# EAGLE design Lora Shield v1.3 (EAGLE 7.3.0)

## Sheet 1 of 2
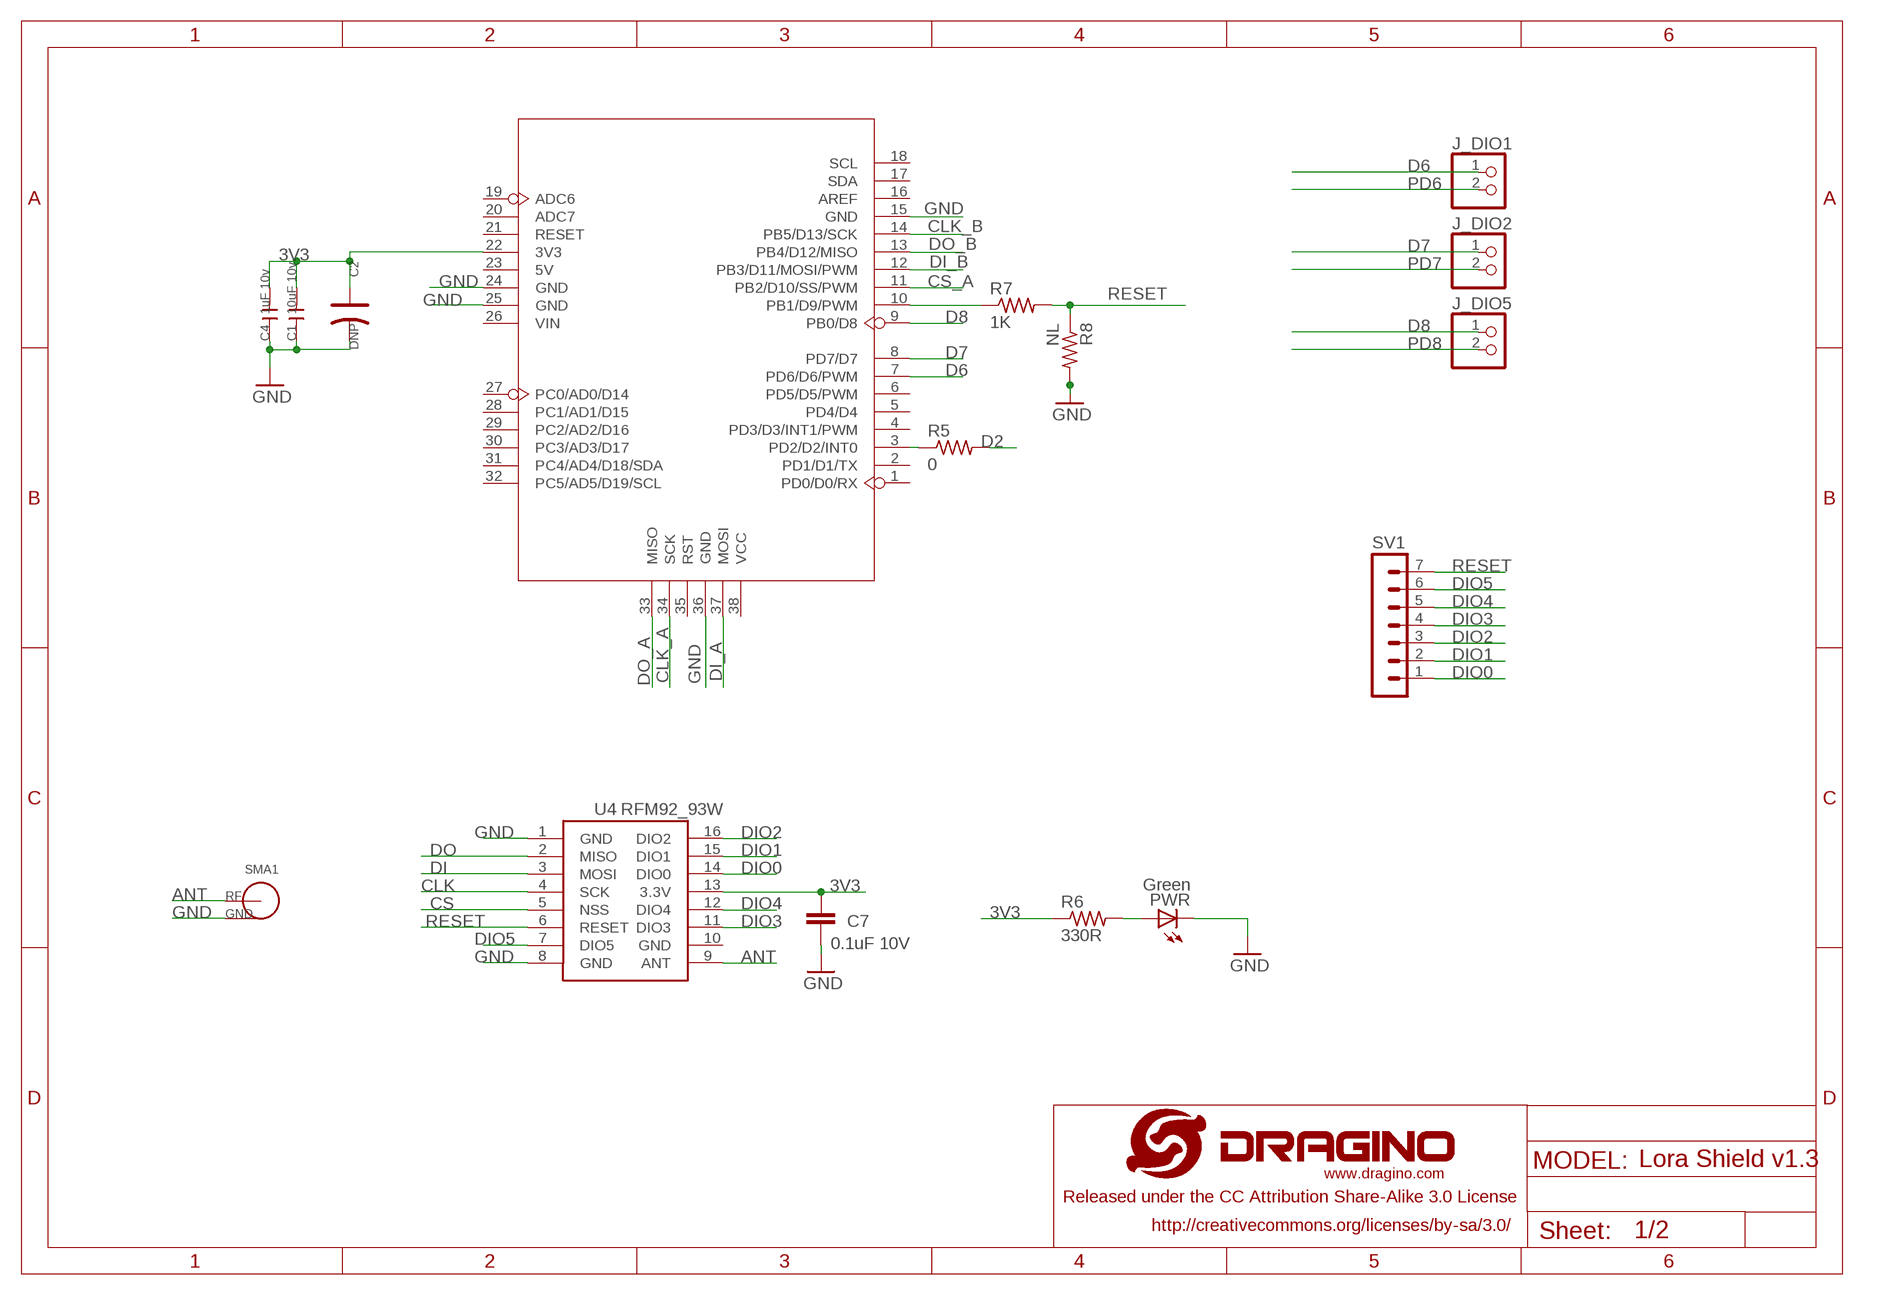
[diagram p0: schematic, sheet 1]

### Parts
C1  10uF 10v  C-0805  [C0805]
C2  DNP  CAP-AVX-A  [AVX-A]
C4  1uF 10v  C-0805  [C0805]
C7  0.1uF 10V  C-EUC0402  [C0402]
J_DIO1  PINHD-1X2  [1X02]
J_DIO2  PINHD-1X2  [1X02]
J_DIO5  PINHD-1X2  [1X02]
PWR  Green  LEDCHIP-LED0603  [CHIP-LED0603]
R5  0  R-US_R0603  [R0603]
R6  330R  R-US_R0402  [R0402]
R7  1K  R-US_R0402  [R0402]
R8  NL  R-US_R0402  [R0402]
SMA1  SMA-KWE  [SMA-KWE]
SV1  MA07-1  [MA07-1]
U4  RFM92_93W  [RFM92_93W]
U5  MOUDLE_ARDUINO-38P328P_NO_VIA  [MOUDLE_ARDUINO-328P--]
U$1  LOGO-NEW  [LOGO-SILK-NEW]

### Nets
3V3: C1.2 C2.+ C4.2 C7.2 R6.1 U4.13(3.3V) U5.22(3V3) ; also sheet 2
ANT: SMA1.1(SIG) U4.9(ANT)
CLK: U4.4(SCK) ; also sheet 2
CLK_A: U5.34(SCK) ; also sheet 2
CLK_B: U5.14(PB5/D13/SCK) ; also sheet 2
CS: U4.5(NSS) ; also sheet 2
CS_A: U5.11(PB2/D10/SS/PWM) ; also sheet 2
D2: R5.2 ; also sheet 2
D6: J_DIO1.1 U5.7(PD6/D6/PWM)
D7: J_DIO2.1 U5.8(PD7/D7)
D8: J_DIO5.1 U5.9(PB0/D8)
DI: U4.3(MOSI) ; also sheet 2
DI_A: U5.37(MOSI) ; also sheet 2
DI_B: U5.12(PB3/D11/MOSI/PWM) ; also sheet 2
DIO0: SV1.1 U4.14(DIO0) ; also sheet 2
DIO1: SV1.2 U4.15(DIO1) ; also sheet 2
DIO2: SV1.3 U4.16(DIO2) ; also sheet 2
DIO3: SV1.4 U4.11(DIO3)
DIO4: SV1.5 U4.12(DIO4)
DIO5: SV1.6 U4.7(DIO5) ; also sheet 2
DO: U4.2(MISO) ; also sheet 2
DO_A: U5.33(MISO) ; also sheet 2
DO_B: U5.13(PB4/D12/MISO) ; also sheet 2
GND: C1.1 C2.- C4.1 C7.1 PWR.C R8.2 SMA1.2(GND) SMA1.3(GND) SMA1.4(GND) SMA1.5(GND) U4.1(GND) U4.8(GND) U5.15(GND) U5.25(GND) U5.36(GND) ; also sheet 2
N$1: R5.1 U5.3(PD2/D2/INT0)
N$6: PWR.A R6.2
N$7: R7.1 U5.10(PB1/D9/PWM)
PD6: J_DIO1.2 ; also sheet 2
PD7: J_DIO2.2 ; also sheet 2
PD8: J_DIO5.2 ; also sheet 2
RESET: R7.2 R8.1 SV1.7 U4.6(RESET)
Unconnected: U5.1(PD0/D0/RX) U5.2(PD1/D1/TX) U5.4(PD3/D3/INT1/PWM) U5.5(PD4/D4) U5.6(PD5/D5/PWM) U5.16(AREF) U5.17(SDA) U5.18(SCL) U5.19(ADC6) U5.20(ADC7) U5.21(RESET) U5.23(5V) U5.24(GND) U5.26(VIN) U5.27(PC0/AD0/D14) U5.28(PC1/AD1/D15) U5.29(PC2/AD2/D16) U5.30(PC3/AD3/D17) U5.31(PC4/AD4/D18/SDA) U5.32(PC5/AD5/D19/SCL) U5.35(RST) U5.38(VCC)

## Sheet 2 of 2
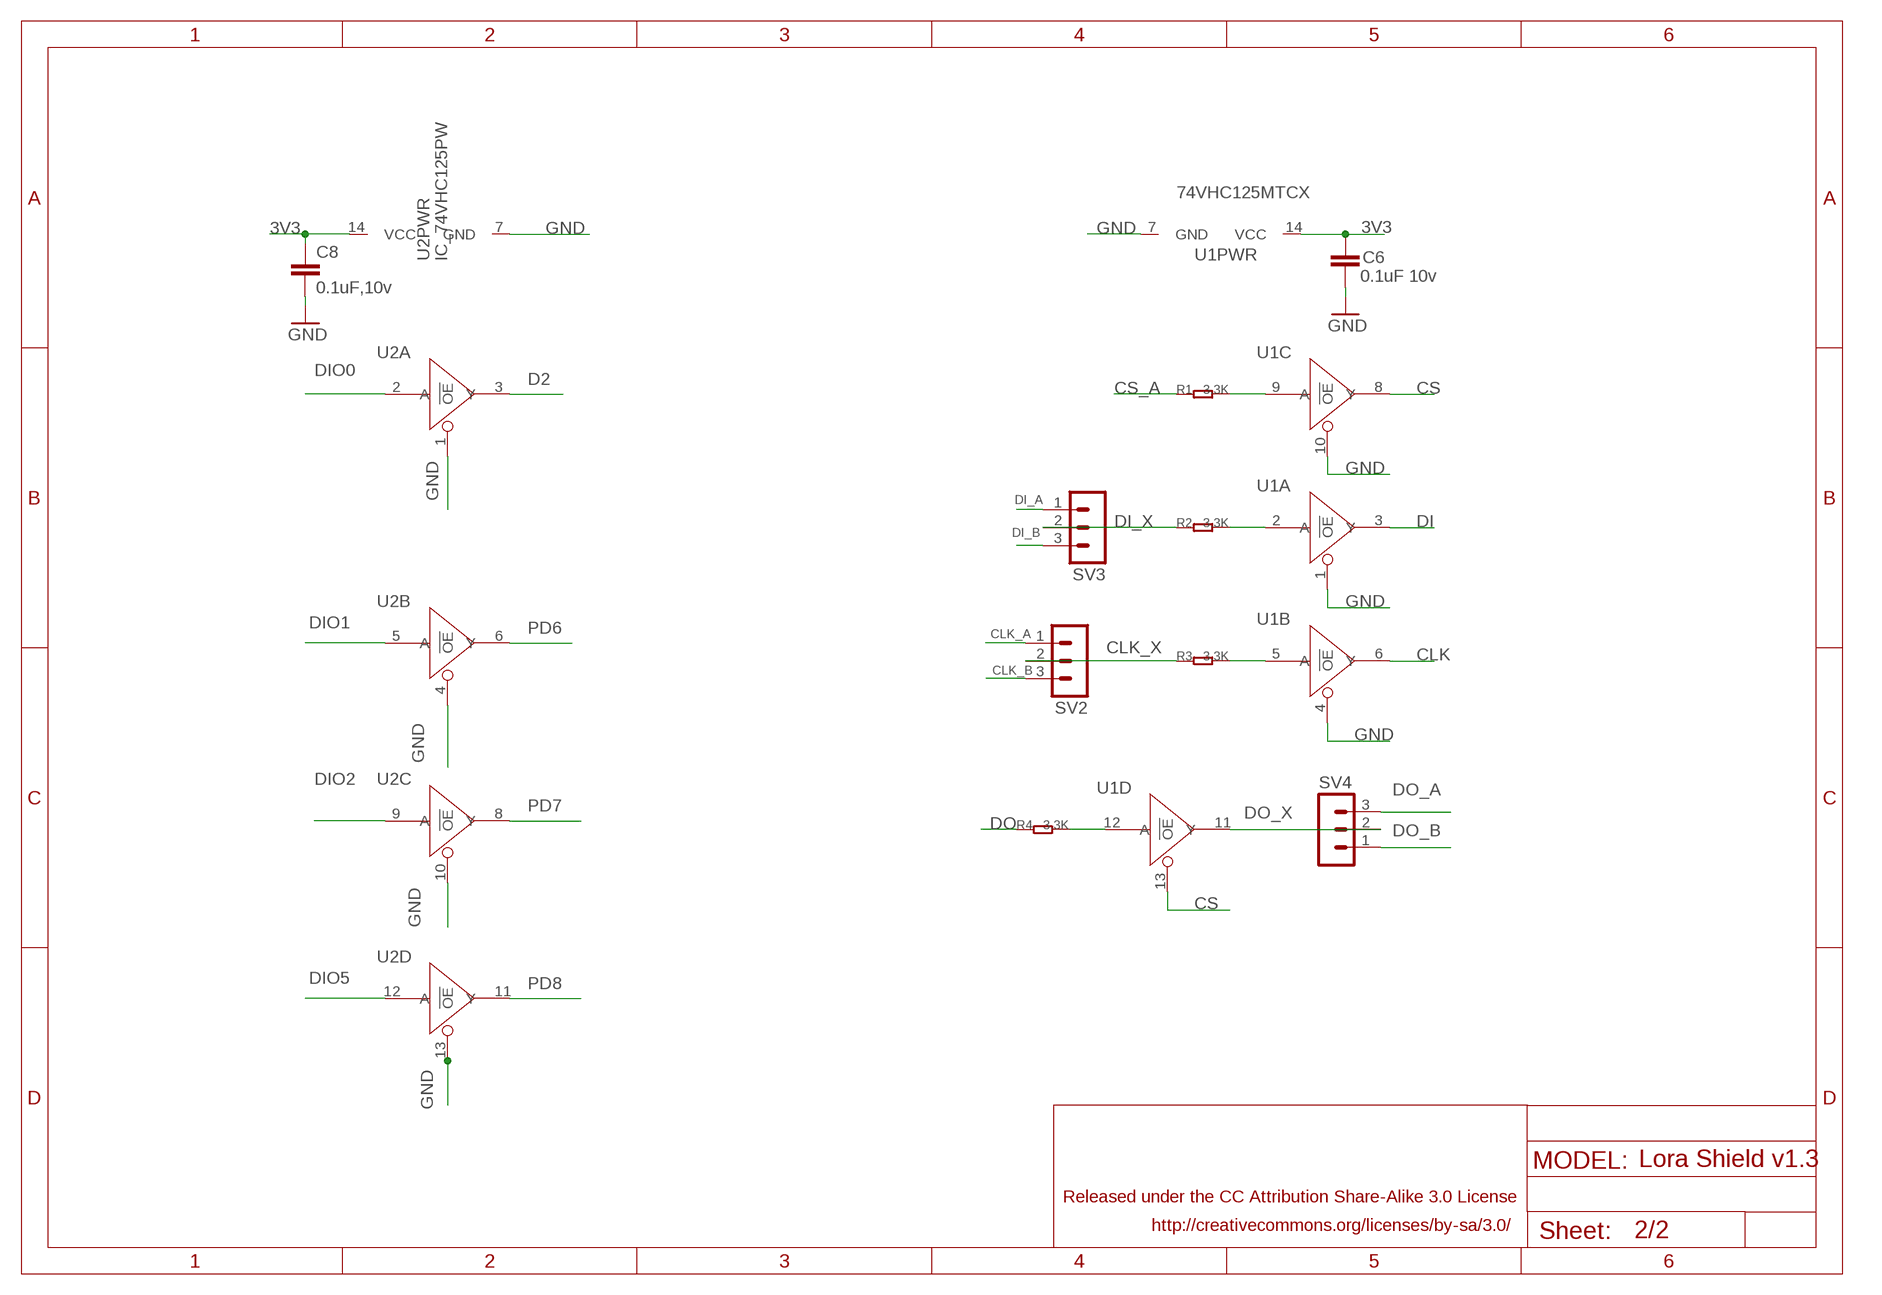
[diagram p1: schematic, sheet 2]

### Parts
C6  0.1uF 10v  C-EUC0805  [C0805]
C8  0.1uF,10v  C-EUC0805  [C0805]
R1  3.3K  R-0603  [R0603]
R2  3.3K  R-0603  [R0603]
R3  3.3K  R-0603  [R0603]
R4  3.3K  R-0603  [R0603]
SV2  MA03-1  [MA03-1]
SV3  MA03-1  [MA03-1]
SV4  MA03-1  [MA03-1]
U1  74VHC125MTCX  74VHC125PW  [TSSOP14]
U2  IC_74VHC125PW  [IC_TSSOP14]

### Nets
3V3: C6.2 C8.1 U1.14(PWR:VCC) U2.14(PWR:VCC) ; also sheet 1
CLK: U1.6(B:Y) ; also sheet 1
CLK_A: SV2.1 ; also sheet 1
CLK_B: SV2.3 ; also sheet 1
CLK_X: R3.1 SV2.2
CS: U1.8(C:Y) U1.13(D:!OE) ; also sheet 1
CS_A: R1.1 ; also sheet 1
D2: U2.3(A:Y) ; also sheet 1
DI: U1.3(A:Y) ; also sheet 1
DI_A: SV3.1 ; also sheet 1
DI_B: SV3.3 ; also sheet 1
DI_X: R2.1 SV3.2
DIO0: U2.2(A:A) ; also sheet 1
DIO1: U2.5(B:A) ; also sheet 1
DIO2: U2.9(C:A) ; also sheet 1
DIO5: U2.12(D:A) ; also sheet 1
DO: R4.1 ; also sheet 1
DO_A: SV4.3 ; also sheet 1
DO_B: SV4.1 ; also sheet 1
DO_X: SV4.2 U1.11(D:Y)
GND: C6.1 C8.2 U1.1(A:!OE) U1.4(B:!OE) U1.7(PWR:GND) U1.10(C:!OE) U2.1(A:!OE) U2.4(B:!OE) U2.7(PWR:GND) U2.10(C:!OE) U2.13(D:!OE) ; also sheet 1
N$2: R4.2 U1.12(D:A)
N$3: R3.2 U1.5(B:A)
N$4: R2.2 U1.2(A:A)
N$5: R1.2 U1.9(C:A)
PD6: U2.6(B:Y) ; also sheet 1
PD7: U2.8(C:Y) ; also sheet 1
PD8: U2.11(D:Y) ; also sheet 1

## Power pins joined to a net without a drawn wire
GND: U4.10(GND)

## Library data of the parts
C1 C4 = Discrete:C*: Ceramic Capacitors
C2 = Discrete:CAP*: Electrolytic Capacitors,Tantalum Capacitors and Super Capacitors
C6-C8 = dragino-passive:C-EU: CAPACITOR, European symbol
J_DIO1 J_DIO2 J_DIO5 = pinhead:PINHD-1X2: PIN HEADER
PWR = dragino:LED: LED OSRAM: - CHIPLED LG R971, LG N971, LY N971, LG Q971, LY Q971, LO R971, LY R971 LH N974, LH R974 LS Q976, LO Q976, LY Q976 LO Q996 - Hyper CHIPLED LW Q18S LB Q993, LB Q99A, LB R99A - SideLED LS A670, LO A670, LY A670, LG A670, LP A670 LB A673, LV A673, LT A673, LW A673 LH A674 LY A675 LS A676, LA A676, LO A676, LY A676, LW A676 LS A679, LY A679, LG A679 - Hyper Micro SIDELED® LS Y876, LA Y876, LO Y876, LY Y876 LT Y87S - SmartLED LW L88C, LW L88S LB L89C, LB L89S, LG L890 LS L89K, LO L89K, LY L89K LS L896, LA L896, LO L896, LY L896 - TOPLED LS T670, LO T670, LY T670, LG T670, LP T670 LSG T670, LSP T670, LSY T670, LOP T670, LYG T670 LG T671, LOG T671, LSG T671 LB T673, LV T673, LT T673, LW T673 LH T674 LS T676, LA T676, LO T676, LY T676, LB T676, LH T676, LSB T676, LW T676 LB T67C, LV T67C, LT T67C, LS T67K, LO T67K, LY T67K, LW E67C LS E67B, LA E67B, LO E67B, LY E67B, LB E67C, LV E67C, LT E67C LW T67C LS T679, LY T679, LG T679 LS T770, LO T770, LY T770, LG T770, LP T770 LB T773, LV T773, LT T773, LW T773 LH T774 LS E675, LA E675, LY E675, LS T675 LS T776, LA T776, LO T776, LY T776, LB T776 LHGB T686 LT T68C, LB T68C - Hyper Mini TOPLED® LB M676 - Mini TOPLED Santana® LG M470 LS M47K, LO M47K, LY M47K Source: http://www.osram.convergy.de LUXEON: - LUMILED® LXK2-PW12-R00, LXK2-PW12-S00, LXK2-PW14-U00, LXK2-PW14-V00 LXK2-PM12-R00, LXK2-PM12-S00, LXK2-PM14-U00 LXK2-PE12-Q00, LXK2-PE12-R00, LXK2-PE12-S00, LXK2-PE14-T00, LXK2-PE14-U00 LXK2-PB12-K00, LXK2-PB12-L00, LXK2-PB12-M00, LXK2-PB14-N00, LXK2-PB14-P00, LXK2-PB14-Q00 LXK2-PR12-L00, LXK2-PR12-M00, LXK2-PR14-Q00, LXK2-PR14-R00 LXK2-PD12-Q00, LXK2-PD12-R00, LXK2-PD12-S00 LXK2-PH12-R00, LXK2-PH12-S00 LXK2-PL12-P00, LXK2-PL12-Q00, LXK2-PL12-R00 Source: www.luxeon.com KINGBRIGHT: KA-3528ASYC Source: www.kingbright.com
R1-R4 = Discrete:R*
R5 = resistor:R-US_: RESISTOR, American symbol
R6-R8 = dragino:R-US_: RESISTOR, American symbol
SMA1 = dragino:SMA-KWE
SV1 = con-lstb:MA07-1: PIN HEADER; OC_FARNELL: unknown; OC_NEWARK: unknown
SV2-SV4 = con-lstb:MA03-1: PIN HEADER; OC_FARNELL: unknown; OC_NEWARK: unknown
U1 = IC:74V*125: Quad Buffer/Line Driver;3-state
U2 = Lora Shield v1.1.1:IC_74V*125: Quad Buffer/Line Driver;3-state
U4 = dragino:RFM92_93W
U5 = board_arduino:MOUDLE_ARDUINO-38P
U$1 = dragino:LOGO-NEW

## Net classes
0 default: clearance 0.205 mm
2 gnd: width 0.305 mm, drill 0.305 mm, clearance 0.254 mm

## Board
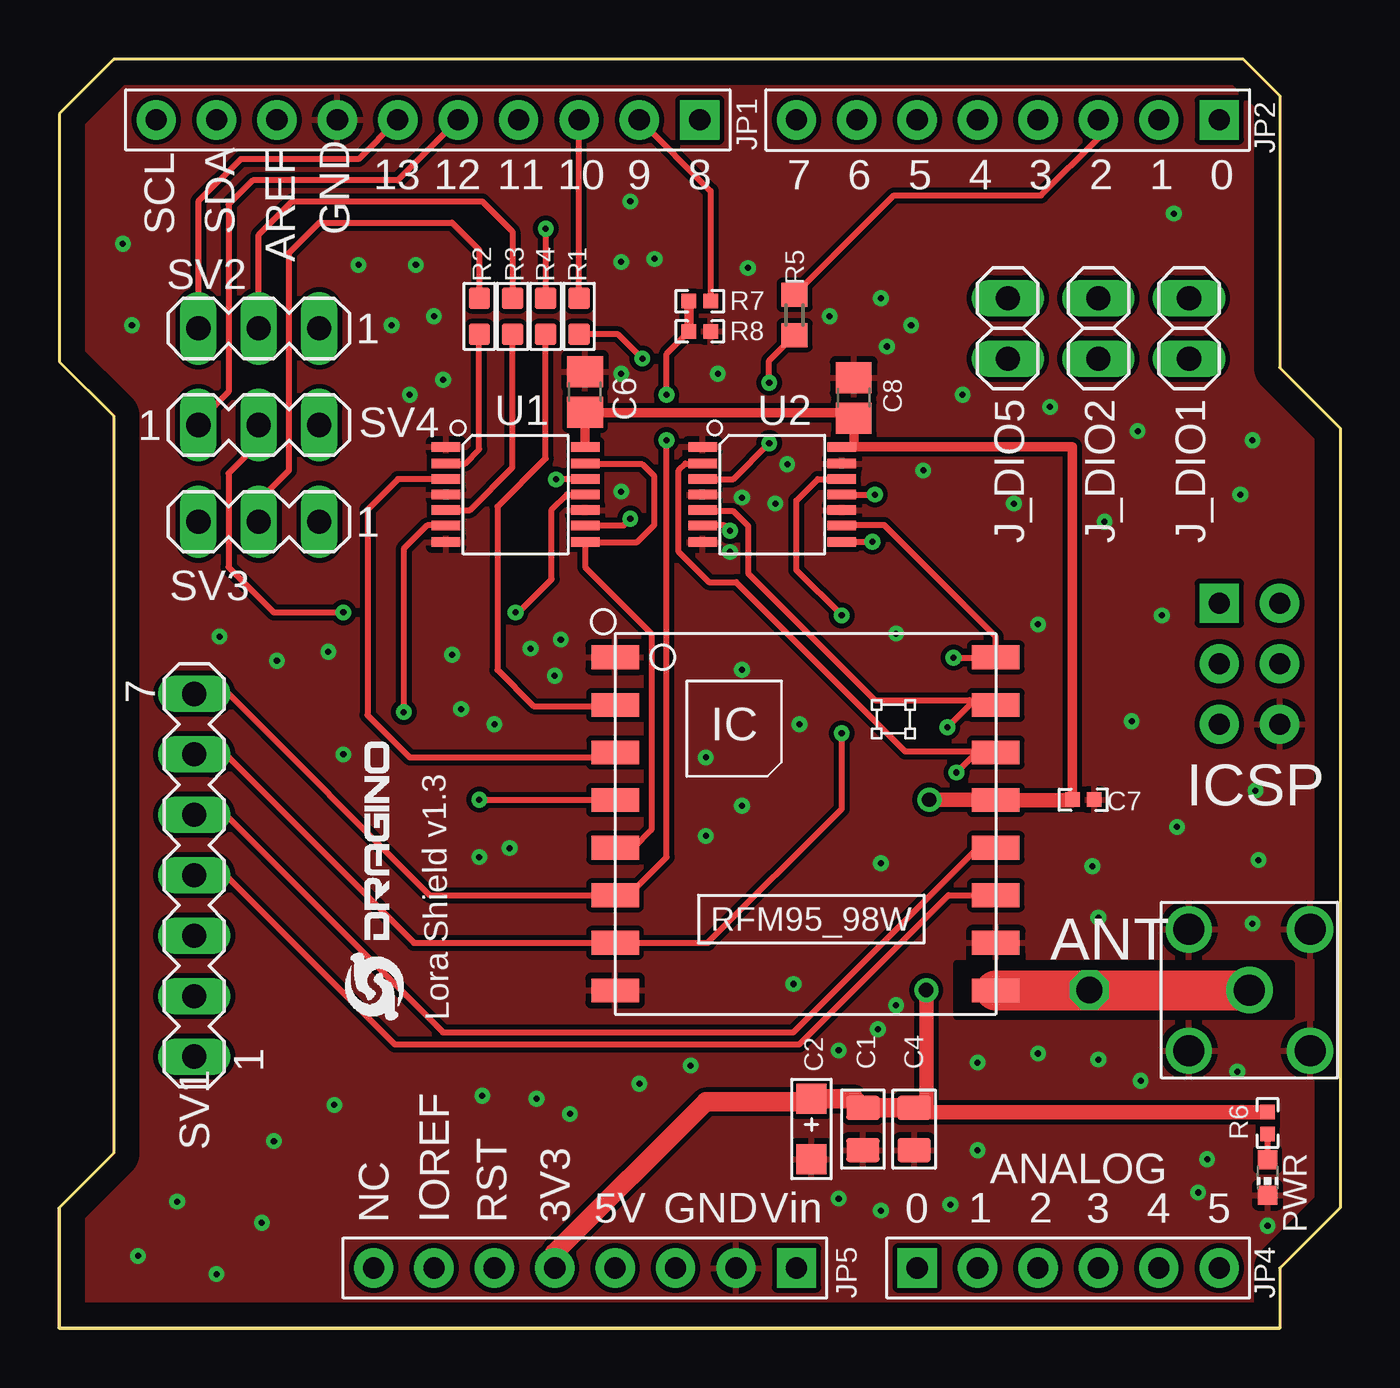
[diagram p2: board, top side]
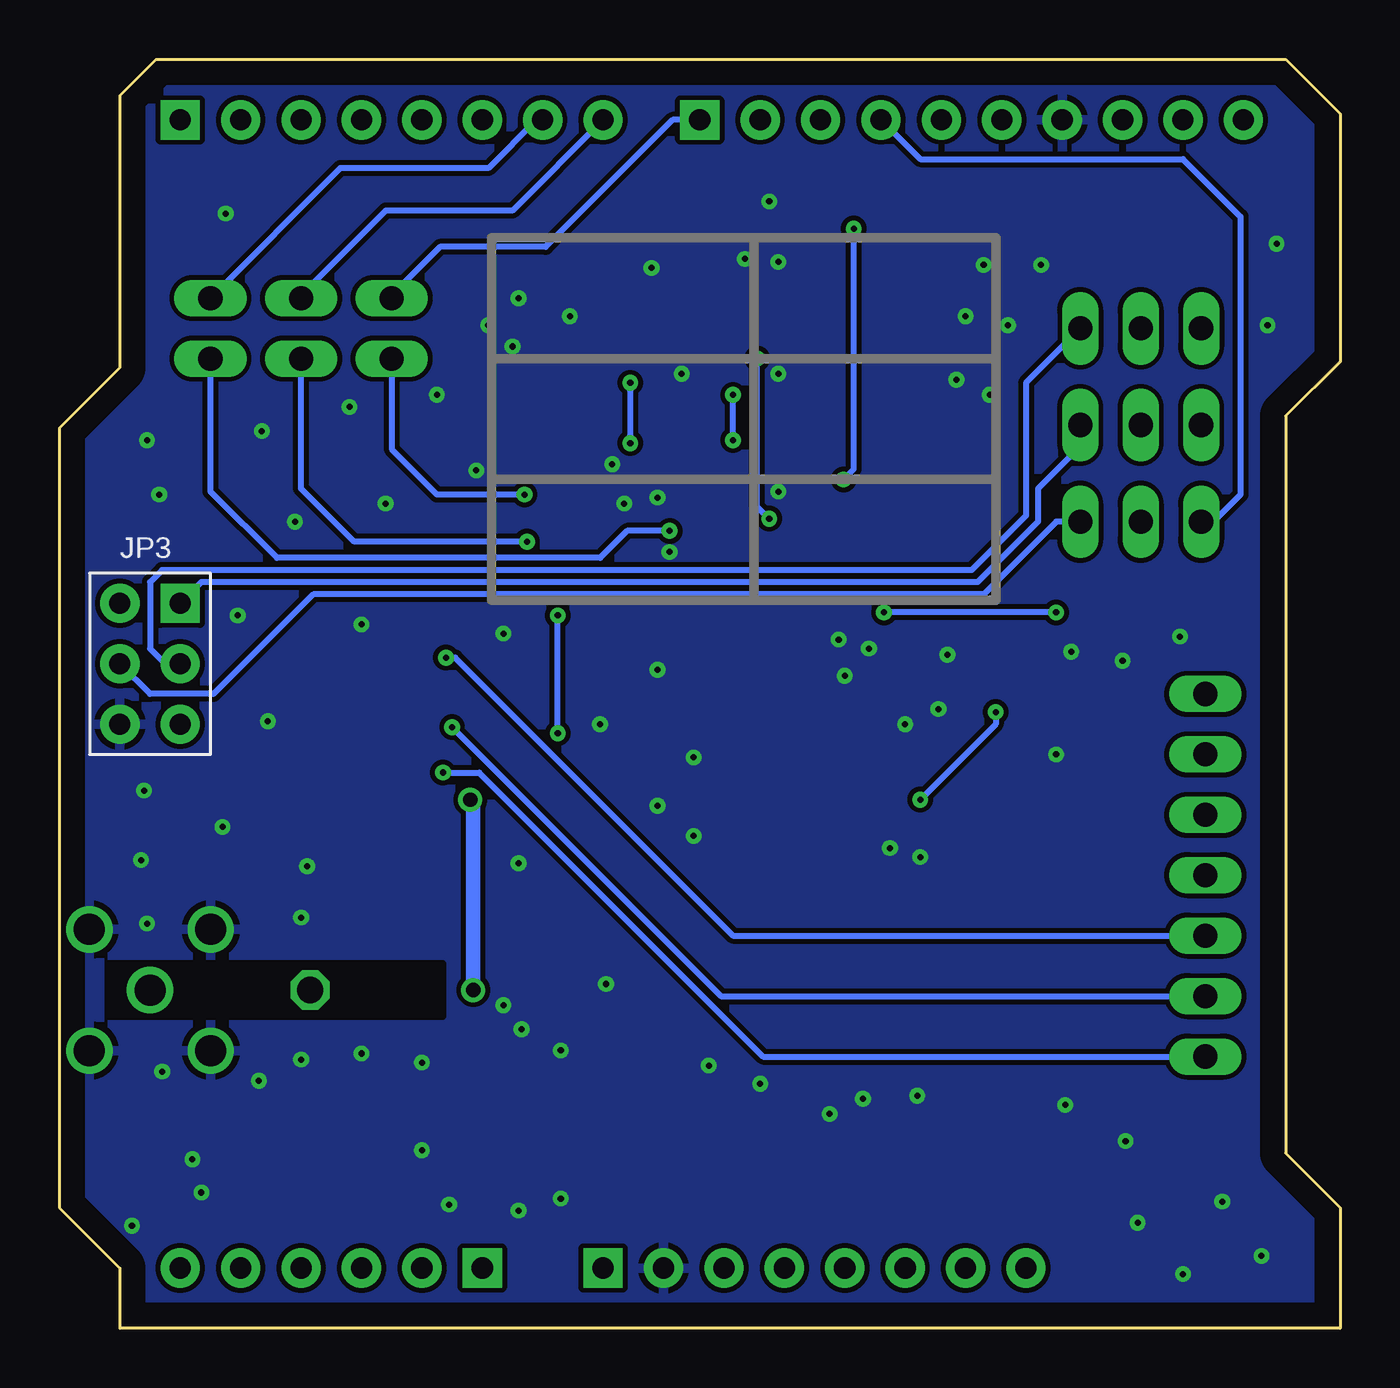
[diagram p3: board, bottom side, seen from below]

Size 53.85 x 53.34 mm. Coordinates in mm from the lower left corner, seen from the top.
Copper layers (1*16): Top 0.035mm / dielectric 1.5mm / Bottom 0.035mm
Design rules "default *": minimum track width 10mil, minimum drill 10mil, track to track 8mil, track to pad 8mil, pad to pad 8mil, via to via 8mil, smd to smd 8mil, copper to edge 40mil, drill to drill 8mil, minimum pad ring 10mil, minimum via ring 8mil, stop-mask expansion 4mil, vias tented up to drill 30mil, thermal gap 10mil
tRestrict: area 37.7,13.1 to 51.8,15.4
bRestrict: area 37.7,13.1 to 51.8,15.4

### Footprints (pad centres in the part's own frame; a part is rotated, then mirrored left to right if it is on the bottom)
C0805 = smd 1.016 x 1.397: 1 -0.889,0; 2 0.889,0
AVX-A = smd 1.27 x 1.27: + -1.27,0; - 1.27,0
C0805' = smd 1.3 x 1.5: 1 -0.85,0; 2 0.85,0
C0402 = smd 0.61 x 0.61: 1 -0.457,0; 2 0.457,0
1X02 = drill 1.016 long: 1 -1.27,0; 2 1.27,0
CHIP-LED0603 = smd 0.8 x 0.8: A 0,-0.75; C 0,0.75
R0603 = smd 0.889 x 0.889: 1 -0.762,0; 2 0.762,0
R0603' = smd 1 x 1.1: 1 -0.85,0; 2 0.85,0
R0402 = smd 0.61 x 0.61: 1 -0.457,0; 2 0.457,0
SMA-KWE = drill 1.3: 1 0,0; 2 -2.55,2.55; 3 2.55,2.55; 4 -2.55,-2.55; 5 2.55,-2.55
MA07-1 = drill 1.016 long: 1 -7.62,0; 2 -5.08,0; 3 -2.54,0; 4 0,0; 5 2.54,0; 6 5.08,0; 7 7.62,0
MA03-1 = drill 1.016 long: 1 -2.54,0; 2 0,0; 3 2.54,0
TSSOP14 = smd 0.4 x 1.2: 1 -2,-2.925; 2 -1.3,-2.925; 3 -0.65,-2.925; 4 0,-2.925; 5 0.65,-2.925; 6 1.3,-2.925; 7 2,-2.925; 8 2,2.925; 9 1.3,2.925; 10 0.65,2.925; 11 0,2.925; 12 -0.65,2.925; 13 -1.3,2.925; 14 -2,2.925
IC_TSSOP14 = smd 0.4 x 1.2: 1 -2,-2.925; 2 -1.3,-2.925; 3 -0.65,-2.925; 4 0,-2.925; 5 0.65,-2.925; 6 1.3,-2.925; 7 2,-2.925; 8 2,2.925; 9 1.3,2.925; 10 0.65,2.925; 11 0,2.925; 12 -0.65,2.925; 13 -1.3,2.925; 14 -2,2.925
RFM92_93W = smd 2 x 1: 1 -8,7; 2 -8,5; 3 -8,3; 4 -8,1; 5 -8,-1; 6 -8,-3; 7 -8,-5; 8 -8,-7; 9 8,-7; 10 8,-5; 11 8,-3; 12 8,-1; 13 8,1; 14 8,3; 15 8,5; 16 8,7
MOUDLE_ARDUINO-328P-- = drill 0.889 pad 1.651 square: 1 27.94,24.13; 9 6.096,24.13; 26 10.16,-24.13; 27 15.24,-24.13; 33 27.94,3.81 | drill 0.889 pad 1.651: 2 25.4,24.13; 3 22.86,24.13; 4 20.32,24.13; 5 17.78,24.13; 6 15.24,24.13; 7 12.7,24.13; 8 10.16,24.13; 10 3.556,24.13; 11 1.016,24.13; 12 -1.524,24.13; 13 -4.064,24.13; 14 -6.604,24.13; 15 -9.144,24.13; 16 -11.684,24.13; 17 -14.224,24.13; 18 -16.764,24.13; 19 -7.62,-24.13; 20 -5.08,-24.13; 21 -2.54,-24.13; 22 0,-24.13; 23 2.54,-24.13; 24 5.08,-24.13; 25 7.62,-24.13; 28 17.78,-24.13; 29 20.32,-24.13; 30 22.86,-24.13; 31 25.4,-24.13; 32 27.94,-24.13; 34 27.94,1.27; 35 27.94,-1.27; 36 30.48,-1.27; 37 30.48,1.27; 38 30.48,3.81

### Placement (x,y rotation side)
C1  33.78,8.38 90 top
C2  31.62,8.38 270 top
C4  35.94,8.38 90 top
C6  0.1uF 10v  [C0805']  22.1,39.37 270 top
C7  43.05,22.23 180 top
C8  0.1uF,10v  [C0805']  33.4,39.12 90 top
J_DIO1  47.5,42.04 270 top
J_DIO2  43.69,42.04 270 top
J_DIO5  39.88,42.04 270 top
PWR  50.8,6.35 180 top
R1  21.84,42.55 270 top
R2  17.65,42.55 270 top
R3  19.05,42.55 270 top
R4  20.45,42.55 90 top
R5  0  [R0603']  30.91,42.6 270 top
R6  50.8,8.64 270 top
R7  26.92,43.18 180 top
R8  26.92,41.91 0 top
SMA1  50.04,14.22 0 top
SV1  5.66,19.05 90 top
SV2  8.38,42.04 180 top
SV3  8.38,33.91 180 top
SV4  8.38,37.97 0 top
U1  19.18,35.05 270 top
U2  29.97,35.05 270 top
U4  31.37,21.21 0 top
U5  20.83,26.67 0 top
U$1  14.48,12.95 90 top

### Tracks (layer width: path | path; a pad name or v marks a point on that pad's centre or on a via)
3V3  (via drill 0.6)
  Top 0.254: 38.86,22.23 38.86,22.21 | 38.61,22.23 38.61,22.1 38.86,22.1 38.86,22.21 | U4.13 38.86,22.21
  Top 0.406: U2.14 33.4,37.05 | 33.4,37.05 C8.1 33.19,38.48 22.1,38.48 | U1.14 22.1,38.48 | 22.1,38.48 C6.2 | 33.4,37.05 42.6,37.05 C7.2
  Top 0.61: C4.2 35.94,9.09 36.45,9.09 | 36.45,9.09 R6.1 | 33.4,38.52 C8.1 | 38.61,22.23 v36.58,22.23 | v36.45,14.22 36.45,9.09 | U4.13 42.6,22.21 C7.2
  Top 0.813: C4.2 C1.2 33.4,9.65 C2.+ 31.5,9.53 27.18,9.53 20.83,3.18 U5.22
  Bottom 0.61: v36.58,22.23 36.45,22.23 v36.45,14.22
ANT  (via drill 1.1)
  Top 0.254: v43.31,14.22 43.31,14.21 U4.9
  Top 1.676: U4.9 50.04,14.21 SMA1.1
CLK  (via drill 0.25)
  Top 0.254: U1.6 15.46,33.75 14.48,32.77 v14.48,25.91 | v17.65,22.23 23.37,22.23 U4.4
  Bottom 0.254: v14.48,25.91 14.48,25.4 v17.65,22.23
CLK_A
  Bottom 0.254: SV2.1 13.21,39.75 13.21,34.16 15.49,31.88 49.53,31.88 50.04,31.37 50.04,28.58 49.4,27.94 U5.34
CLK_B
  Top 0.254: U5.14 12.57,49.15 7.62,49.15 5.84,47.37 SV2.3
CLK_X
  Top 0.254: SV2.2 8.38,45.97 9.78,47.37 17.78,47.37 19.05,46.1 R3.1
CS
  Top 0.254: U4.5 23.38,20.19 24.13,20.19 24.89,20.96 24.89,29.21 22.1,32 U1.8 24.29,33.05 25.02,33.78 25.02,35.81 24.51,36.32 22.13,36.32 U1.13
CS_A
  Top 0.254: R1.1 U5.11
D2  (via drill 0.25)
  Top 0.254: U2.3 28.34,35.7 v29.84,37.21 | v29.84,39.75 29.84,40.68 R5.2
  Bottom 0.254: v29.84,37.21 v29.84,39.75
D6
  Bottom 0.254: U5.7 33.78,50.8 35.81,48.77 42.04,48.77 J_DIO1.1
D7
  Bottom 0.254: U5.8 34.8,46.99 40.13,46.99 43.69,43.43 J_DIO2.1
D8
  Bottom 0.254: U5.9 28.07,50.8 33.4,45.47 37.85,45.47 39.88,43.43 J_DIO5.1
DI
  Top 0.254: U1.3 14.24,35.7 12.95,34.42 12.95,25.78 14.73,24 23.16,24 U4.3
DI_A
  Bottom 0.254: SV3.1 11.94,33.91 14.99,30.86 43.18,30.86 47.37,26.67 50.04,26.67 U5.37
DI_B
  Bottom 0.254: U5.12 17.65,49.15 6.6,49.15 4.19,46.74 4.19,35.05 5.33,33.91 SV3.3
DI_X
  Top 0.254: SV3.2 8.38,34.8 9.65,36.07 9.65,45.21 10.92,46.48 16.51,46.48 17.65,45.34 R2.1
DIO0  (via drill 0.25)
  Top 0.254: v37.72,23.37 38.56,24.21 U4.14 39.32,24.26 35.56,24.26 28.45,31.37 27.3,31.37 26.03,32.64 26.03,36.07 26.32,36.35 U2.2 27.02,36.32
  Bottom 0.254: v37.72,23.37 36.19,23.37 24.26,11.43 SV1.1
DIO1  (via drill 0.25)
  Top 0.254: U4.15 38.48,26.21 | 38.48,26.21 38.27,26.21 v37.34,25.27 | U2.5 27.06,34.42 27.11,34.37 28.32,34.37 28.96,33.73 28.96,31.75 34.29,26.42 38.27,26.42 38.48,26.21
  Bottom 0.254: v37.34,25.27 26.03,13.97 SV1.2
DIO2  (via drill 0.25)
  Top 0.254: U2.9 32.93,33.78 34.67,33.78 39.37,29.08 U4.16 39.35,28.19 v37.59,28.19
  Bottom 0.254: v37.59,28.19 37.21,28.19 25.53,16.51 SV1.3
DIO3
  Top 0.254: SV1.4 6.98,19.05 14.1,11.94 31.11,11.94 37.39,18.21 U4.11
DIO4
  Top 0.254: SV1.5 6.98,21.59 16.13,12.45 30.86,12.45 38.62,20.21 U4.12
DIO5  (via drill 0.25)
  Top 0.254: SV1.6 6.98,24.13 14.91,16.21 U4.7 27.26,16.21 32.89,21.84 v32.89,25.02 | v32.89,29.97 30.99,31.88 30.99,34.8 31.89,35.7 U2.12
  Bottom 0.254: v32.89,25.02 v32.89,29.97
DO
  Top 0.254: U4.2 23.32,26.16 19.94,26.16 18.41,27.69 18.41,34.54 20.45,36.58 R4.1
DO_A
  Bottom 0.254: SV4.3 10.92,37.08 12.7,35.31 12.7,33.91 15.24,31.37 47.88,31.37 U5.33
DO_B
  Top 0.254: U5.13 14.22,48.26 8.13,48.26 7.11,47.24 7.11,39.37 5.84,38.1 SV4.1
DO_X  (via drill 0.25)
  Top 0.254: SV4.2 8.38,37.21 7.11,35.94 7.11,32 9.02,30.1 v11.94,30.1 | v19.18,30.1 19.3,30.1 20.7,31.5 20.7,34.42 21.34,35.05 U1.11
  Bottom 0.254: v11.94,30.1 v19.18,30.1
GND  (via drill 0.25)
  other vias: 9.02,7.87 11.56,9.4 17.78,9.78 21.46,9.02 8.51,4.45 3.3,3.05 4.95,5.33 6.6,2.29 26.54,11.05 20.07,9.65 24.38,10.29 32.77,11.68 34.42,12.57 35.18,13.59 32.77,5.46 34.54,4.95 37.46,5.21 38.61,7.49 38.61,11.18 41.15,11.56 43.69,11.3 45.47,10.41 50.16,17.02 49.53,10.8 48.26,7.11 50.8,4.32 47.88,5.72 50.29,22.61 41.15,29.59 50.42,19.69 43.43,19.43 43.69,17.27 45.08,25.53 34.54,19.56 30.86,14.48 27.18,20.7 28.7,21.97 31.11,25.4 28.7,27.69 35.18,29.21 46.99,21.08 43.94,33.91 36.32,36.07 50.16,37.34 35.81,42.16 40.13,34.67 37.97,39.24 28.7,34.92 34.8,41.28 27.69,40.13 23.62,35.18 16.13,39.88 14.73,39.24 16.51,28.32 16.89,26.04 18.29,25.4 9.14,28.07 11.3,28.45 6.73,29.08 11.94,24.13 17.65,19.81 18.92,20.19 14.99,44.7 12.57,44.7 13.97,42.16 15.75,42.55 2.67,45.59 3.05,42.16 24,47.37 25.02,44.96 28.96,44.58 32.38,42.55 23.62,40.13 34.54,43.31 49.66,35.05 23.62,44.83 30.1,34.67 28.19,32.64 21.08,28.96 20.83,27.43 19.81,28.58 27.18,24 45.34,37.72 46.86,46.86 30.61,36.32 41.66,38.73 46.35,29.97
  pour Top: -0.38,53.72 54.48,53.98 54.23,-0.13 -0.13,-0.13 -0.38,52.7
  pour Bottom: -0.28,53.75 -0.53,-0.18 53.54,-0.3 54.08,-0.28 54.48,53.75 48.84,53.77
N$1
  Top 0.254: R5.1 35.09,47.62 41.27,47.62 43.69,50.04 U5.3
N$2  (via drill 0.25)
  Top 0.254: U1.12 22.09,35.69 v20.88,35.69 | v20.45,46.23 R4.2
  Bottom 0.254: v20.45,46.23 20.45,36.12 v20.88,35.69
N$3
  Top 0.254: U1.5 17.26,34.4 19.05,36.2 R3.2
N$4
  Top 0.254: U1.2 17.05,36.35 17.65,36.96 R2.2
N$5  (via drill 0.25)
  Top 0.254: U1.9 23.72,33.75 v24,34.04 | v24.51,40.77 23.49,41.78 R1.2
  Bottom 0.254: v24,34.04 24.51,34.54 v24.51,40.77
N$6
  Top 0.254: PWR.A R6.2
N$7
  Top 0.254: U5.10 27.38,47.8 R7.1
PD6  (via drill 0.25)
  Top 0.254: v28.19,33.53 27.97,33.75 U2.6
  Bottom 0.254: v28.19,33.53 29.97,33.53 31.11,32.39 44.7,32.39 47.5,35.18 J_DIO1.2
PD7  (via drill 0.25)
  Top 0.254: v34.19,33.07 32.92,33.07 U2.8
  Bottom 0.254: J_DIO2.2 43.69,35.31 41.45,33.07 v34.19,33.07
PD8  (via drill 0.25)
  Top 0.254: U2.11 v34.29,35.05
  Bottom 0.254: v34.29,35.05 37.97,35.05 39.88,36.96 J_DIO5.2
RESET  (via drill 0.25)
  Top 0.254: SV1.7 7.11,26.67 15.57,18.21 U4.6 23.92,18.21 25.53,19.81 v25.53,37.34 | v25.53,39.24 25.53,40.97 R8.1
  Top 0.406: R7.2 R8.1
  Bottom 0.254: v25.53,37.34 v25.53,39.24

### Text on the board
tPlace: ICSP | ANT
tNames: Lora Shield v1.3
tDocu: RESET | DIO5 | DIO4 | DIO3 | DIO2 | DIO1 | DIO0
bDocu: 433MHZ | 868MHZ | 915MHZ